# Altium project STM32F030F4_RF433_RELAY_LEARN_CODE.PrjPcb
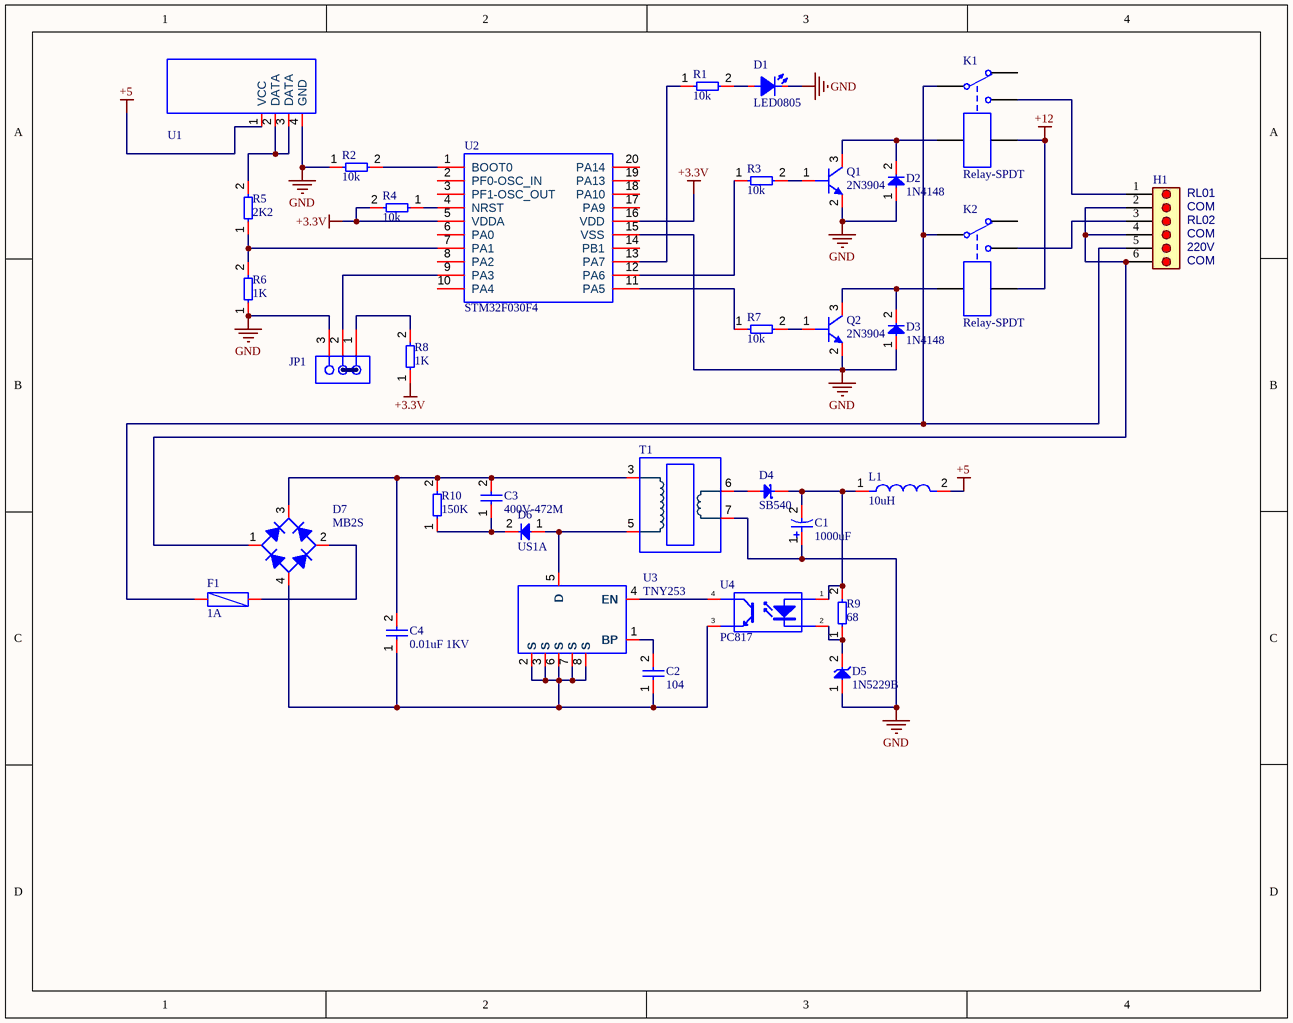
[diagram p0: Sheet1.SchDoc]
1 sheet, 34 parts. Net scope: global (net labels, ports and power ports of the same name join across sheets).
Board file: PCB1.PcbDoc

## Sheet Sheet1.SchDoc
size A

### Parts
C1  1000uF  [CAP_RAD_4mm]
C2  104  [C0805]
C3  400V-472M  [C0805]
C4  0.01uF 1KV  [C1812]
D1  LED0805  [L0805RED]
D2  1N4148  [SOD-80]
D3  1N4148  [SOD-80]
D4  SB540  [DO-214AC(SMA)]
D5  1N5229B  [DO-213AB]
D6  US1A  [DO-214AC(SMA)]
D7  MB2S  [TO-269AA]
F1  1A  [FUSE1812]
H1  Header Big 6  [HEADER BIG 6]  (value not drawn)
JP1  Header 3x1 TH Pitch 2.54mm  [Header 3x1 TH Pitch 2.54mm]  (value not drawn)
K1  Relay-SPDT  [RELAY 5A]
K2  Relay-SPDT  [RELAY 5A]
L1  10uH  [INDUCTOR_1206]
Q1  2N3904  [SOT23-3]
Q2  2N3904  [SOT23-3]
R1  10k  [R0805]
R2  10k  [R0805]
R3  10k  [R0805]
R4  10k  [R0805]
R5  2K2  [R0805]
R6  1K  [R0805]
R7  10k  [R0805]
R8  1K  [R0805]
R9  68  [R0805]
R10  150K  [R0805]
T1  TRANSFORMER_EE16A  [TRANSFORMER_EE16A]  (value not drawn)
U1  RF433_315_RECEVICE  [RF433_315_RECEVICE]  (value not drawn)
U2  STM32F030F4  [TSSOP20_0.65_4.4]
U3  TNY253  [SOIC08_1.27_6.0]
U4  PC817  [DIP4]

### Nets
+3.3V: R4.2 R8.1 U2.5(VDDA) U2.16(VDD)
+5: L1.2 U1.1(VCC)
+12: K1.3 K2.3
GND: C1.1 D1.2(K) D2.1 D3.1 D5.1 JP1.3 Q1.2(E) Q2.2(E) R2.1 R6.1 T1.7 U1.4(GND) U2.15(VSS)
NetC1_2: C1.2 D4.2(K) L1.1 R9.2 U4.1(A)
NetC2_1: C2.1 C4.1 D7.4 U3.2(S) U3.3(S) U3.6(S) U3.7(S) U3.8(S) U4.3(E)
NetC2_2: C2.2 U3.1(BP)
NetC3_1: C3.1 D6.2 R10.1
NetC3_2: C3.2 C4.2 D7.3 R10.2 T1.3
NetD1_1: D1.1(A) R1.2
NetD2_2: D2.2 K1.1 Q1.3(C)
NetD3_2: D3.2 K2.1 Q2.3(C)
NetD4_1: D4.1(A) T1.6
NetD5_2: D5.2 R9.1 U4.2(K)
NetD6_1: D6.1 T1.5 U3.5(D)
NetD7_1: D7.1 H1.2 H1.4 H1.6
NetD7_2: D7.2 F1.2
NetF1_1: F1.1 H1.5 K1.2 K2.2
NetH1_1: H1.1 K1.5
NetH1_3: H1.3 K2.5
NetJP1_1: JP1.1 R8.2
NetJP1_2: JP1.2 U2.9(PA3)
NetQ1_1: Q1.1(B) R3.2
NetQ2_1: Q2.1(B) R7.2
NetR1_1: R1.1 U2.13(PA7)
NetR2_2: R2.2 U2.1(BOOT0)
NetR3_1: R3.1 U2.12(PA6)
NetR4_1: R4.1 U2.4(NRST)
NetR5_1: R5.1 R6.2 U2.7(PA1)
NetR5_2: R5.2 U1.2(DATA) U1.3(DATA)
NetR7_1: R7.1 U2.11(PA5)
NetU3_4: U3.4(EN) U4.4(C)

Not connected (* = marked no-connect by the designer): K1 4; K2 4; U2 2(PF0-OSC_IN) 3(PF1-OSC_OUT) 6(PA0) 8(PA2) 10(PA4) 14(PB1) 17(PA9) 18(PA10) 19(PA13) 20(PA14)

### Notes on the sheet
- (near H1) COM
- (near H1) RL02
- (near H1) RL01
- (near H1) 220V

### Library data of the parts
C1 = Capacitor(Radian)
C2 C3 = C0805
C4 = Capacitors(SMD)
D2 D3 = 1N4148 (SOD-80)
D4 = Diode Schottky
D5 = Diode Zener
D6 = US1A-US1M
D7 = Diode MB2S
F1 = Fuse
L1 = Inductor
Q1 Q2 = 2N3904 (SOT-23)
R1-R10 = Resistor SMD
U1 = RF433_315
U2 = STM32F030F4: 4Kbyte RAM and 16Kb FLASH
K1 K2 = Relay-SPDT: Published: 24-Mar-1999; LatestRevisionDate: 17-Jul-2002; LatestRevisionNote: Re-released for DXP Platform.; PackageReference: MODULE5B; Publisher: Altium Limited